# Altium schematic sheet MainBoard.SchDoc
size A2
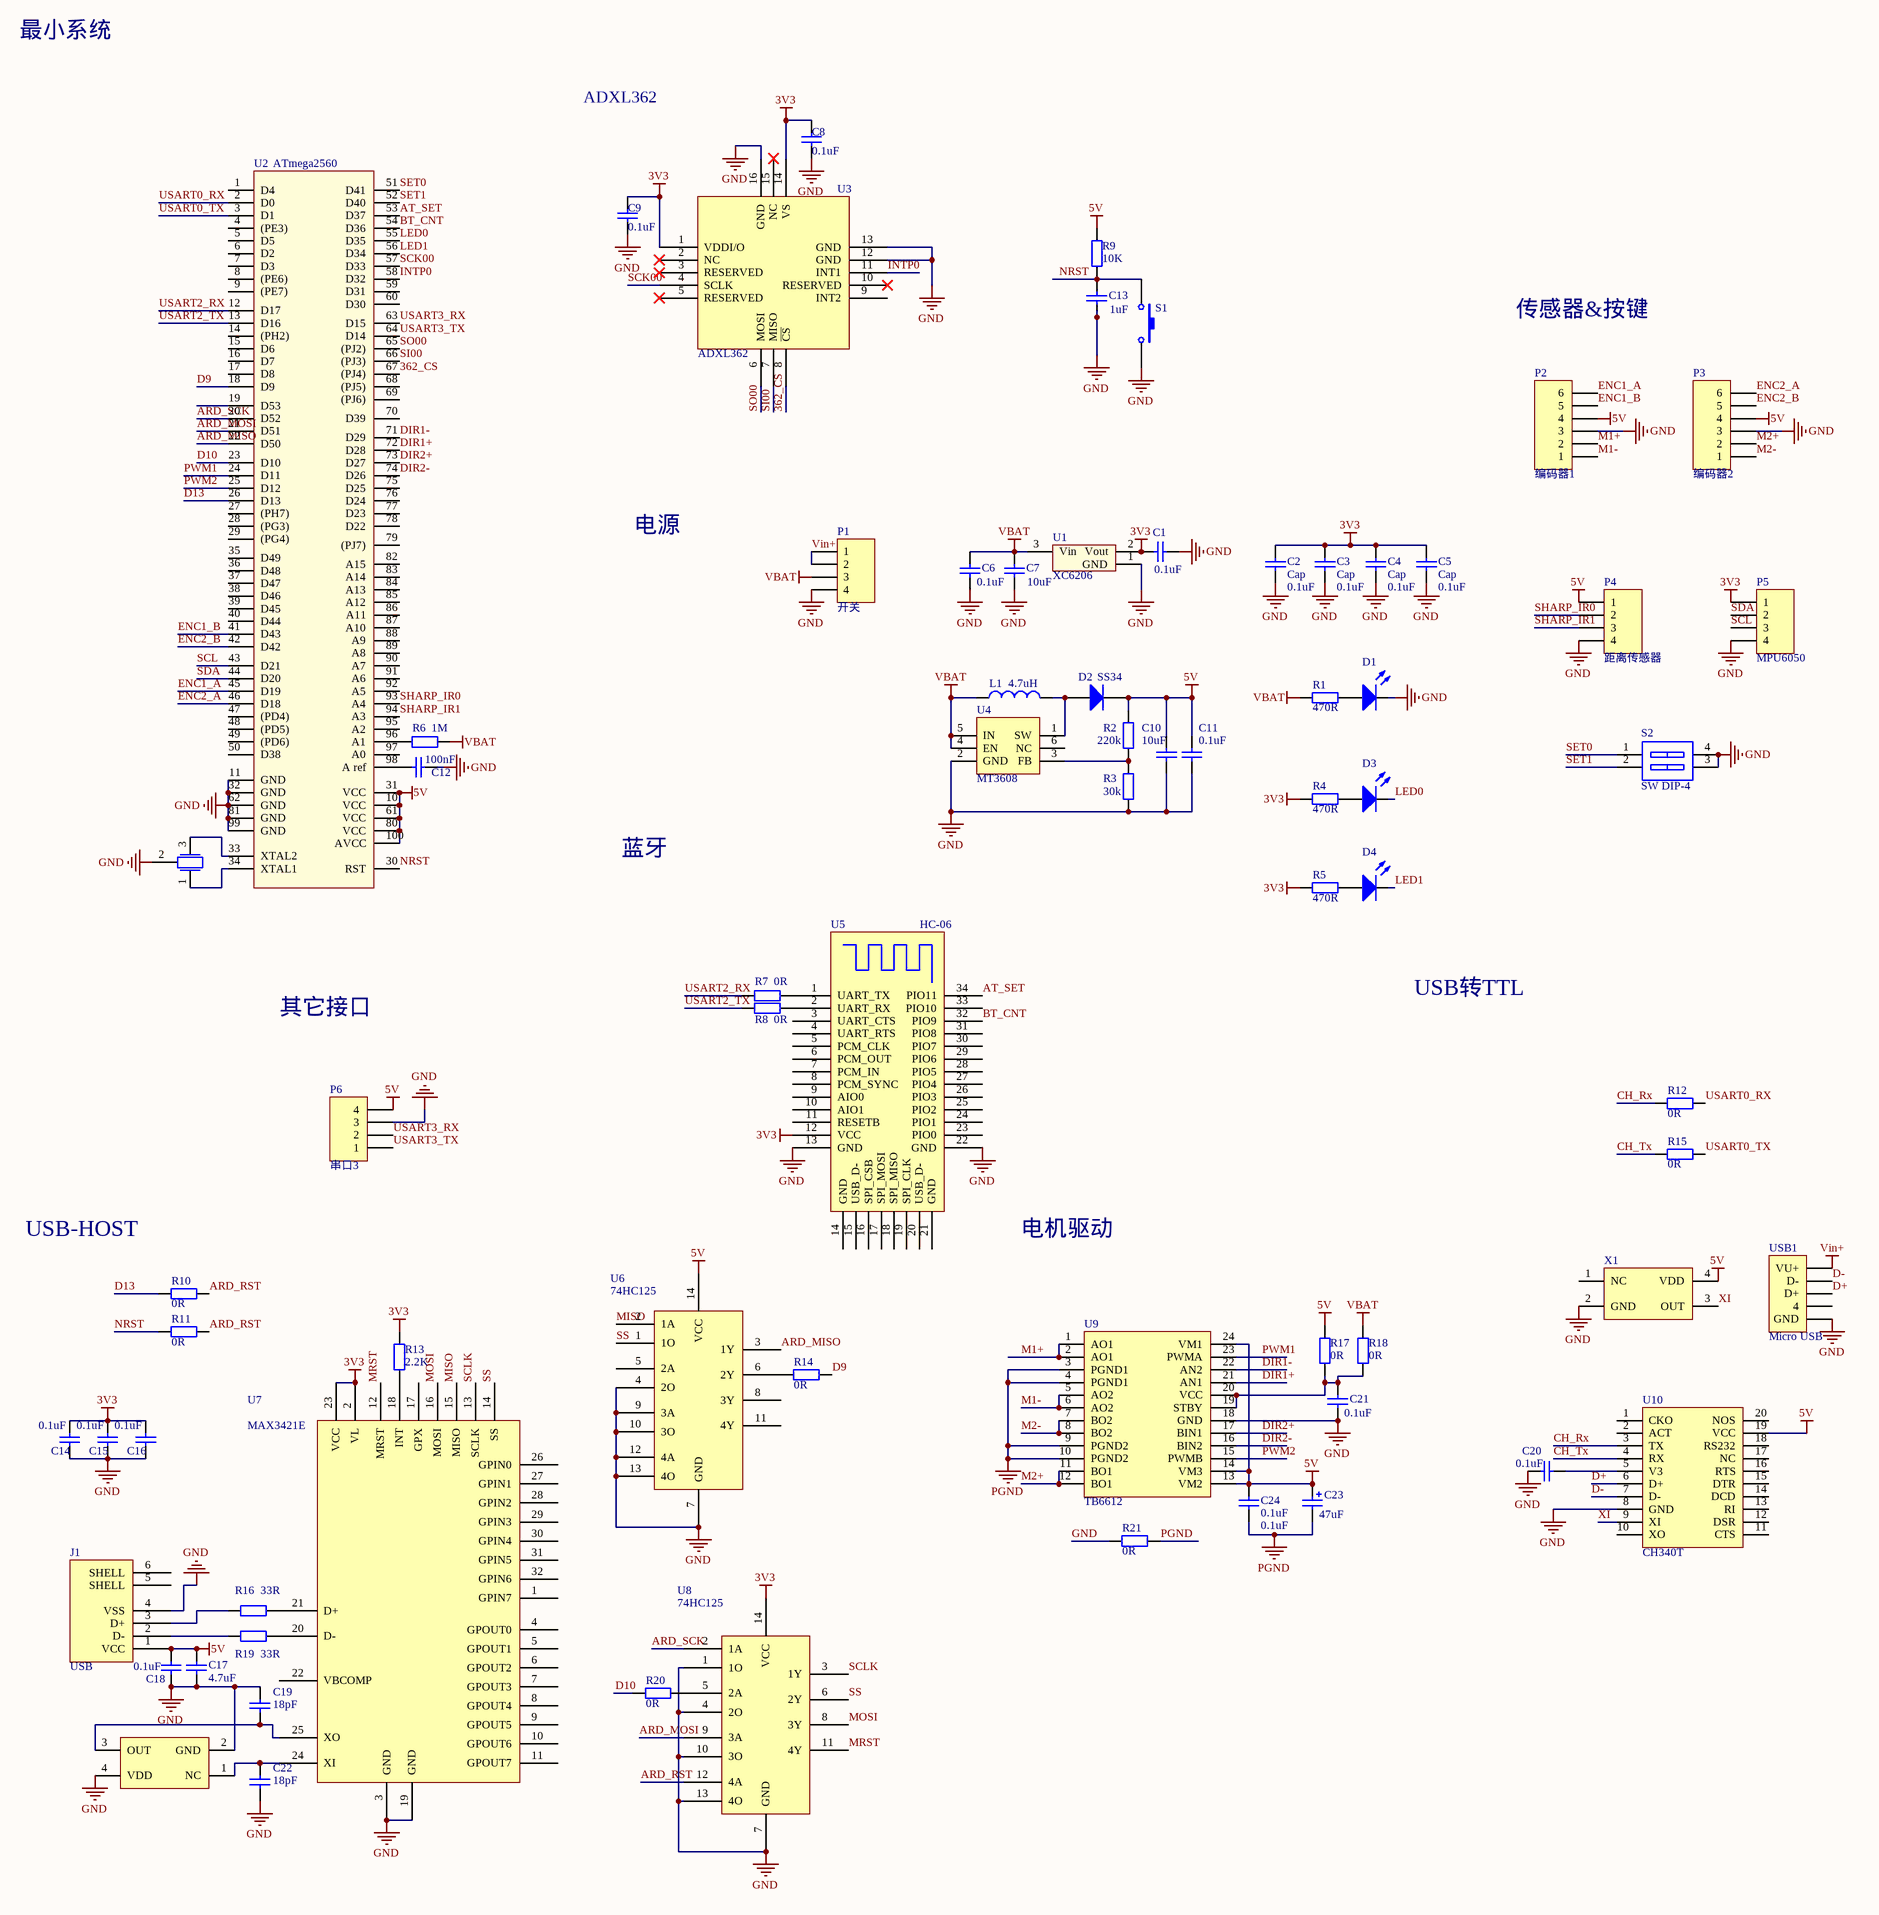
[diagram p0: MainBoard.SchDoc]

## Parts
*1  5032晶振  [5032晶振]  (value not drawn)
C1  value 0.1uF  [0402C]  (hidden comment: Cap)
C2  Cap  value 0.1uF  [0402C]
C3  Cap  value 0.1uF  [0402C]
C4  Cap  value 0.1uF  [0402C]
C5  Cap  value 0.1uF  [0402C]
C6  value 0.1uF  [0402C]  (hidden comment: Cap)
C7  value 10uF  [0603_M]  (hidden comment: Cap)
C8  0.1uF  [0805]
C9  0.1uF  [0805]
C10  10uF  [0603_M]
C11  0.1uF  [0402C]
C12  value 100nF  [0402]  (hidden comment: 电容_0402)
C13  value 1uF  [0402C]  (hidden comment: Cap)
C14  value 0.1uF  [0402]  (hidden comment: 电容_0603)
C15  value 0.1uF  [0402]  (hidden comment: 电容_0603)
C16  value 0.1uF  [0402]  (hidden comment: 电容_0603)
C17  value 4.7uF  [C1206]  (hidden comment: Cap Semi)
C18  value 0.1uF  [0402]  (hidden comment: 电容_0603)
C19  value 18pF  [0402]  (hidden comment: 电容_0603)
C20  value 0.1uF  [0402C]  (hidden comment: Cap)
C21  value 0.1uF  [0603_M]  (hidden comment: value)
C22  value 18pF  [0402]  (hidden comment: 电容_0603)
C23  value 47uF  [CAP 6X7mm 贴片电解]  (hidden comment: 钽电容6x7mm)
C24  0.1uF  [0603_M]
D1  LED  [0603_M]  (value not drawn)
D2  SS34  [DO-214]
D3  LED  [0603_M]  (value not drawn)
D4  LED  [0603_M]  (value not drawn)
J1  USB  [USB_A1]
L1  4.7uH  [贴片电感CD32]
P1  开关  [HDR1X4]
P2  编码器1  [接插件6x1.25mm]
P3  编码器2  [接插件6x1.25mm]
P4  距离传感器  [接插件4x1.25mm]
P5  MPU6050  [接插件4x1.25mm]
P6  串口3  [接插件4x1.25mm]
R1  value 470R  [0402C]  (hidden comment: 电阻_0402)
R2  220k  [0603_M]
R3  30k  [0603_M]
R4  value 470R  [0402C]  (hidden comment: 电阻_0402)
R5  value 470R  [0402C]  (hidden comment: 电阻_0402)
R6  value 1M  [0402C]  (hidden comment: 电阻_0402)
R7  value 0R  [0R电阻]  (hidden comment: 0R电阻)
R8  value 0R  [0R电阻]  (hidden comment: 0R电阻)
R9  value 10K  [0402C]  (hidden comment: Res2)
R10  value 0R  [0R电阻]  (hidden comment: 0R电阻)
R11  value 0R  [0R电阻]  (hidden comment: 0R电阻)
R12  value 0R  [0R电阻]  (hidden comment: 0R电阻)
R13  value 2.2K  [0603_M]  (hidden comment: 电阻_0603)
R14  value 0R  [0R电阻]  (hidden comment: 0R电阻)
R15  value 0R  [0R电阻]  (hidden comment: 0R电阻)
R16  value 33R  [0603_M]  (hidden comment: 电阻_0603)
R17  value 0R  [0R电阻]  (hidden comment: 0R电阻)
R18  value 0R  [0R电阻]  (hidden comment: 0R电阻)
R19  value 33R  [0603_M]  (hidden comment: 电阻_0603)
R20  value 0R  [0R电阻]  (hidden comment: 0R电阻)
R21  value 0R  [0R电阻]  (hidden comment: 0R电阻)
S1  SW-PB  [SW_PB2_A1]  (value not drawn)
S2  SW DIP-4  [SW8_4BIT]
U1  XC6206  [SOT-23]
U2  ATmega2560  [QFP-100]
U3  ADXL362  [MAX21100]
U4  MT3608  [SOT23-6]
U5  HC-06  [HM_01_02_09_10]
U6  74HC125  [SOIC-14]
U7  MAX3421E  [TQFP-32]
U8  74HC125  [SOIC-14]
U9  TB6612  [SOP65P760-24]
U10  CH340T  [SSOP20]
USB1  Micro USB  [USB MICRO]
X1  5032晶振  [5032晶振]  (value not drawn)
Y1  XTAL-3PIN  [X-CPX20]  (value not drawn)

## Nets
3V3: C1.1 C2.2 C3.2 C4.2 C5.2 C8.2 C9.2 C14.1 C15.1 C16.1 P5.1 R4.1 R5.1 R13.2 U1.2(Vout) U3.1(VDDI/O) U3.14(VS) U5.12(VCC) U7.2(VL) U7.23(VCC) U8.14(VCC)
5V: C10.2 C11.2 C17.2 C18.1 C23.1 C24.2 D2.2(K) J1.1(VCC) P2.4 P3.4 P4.1 P6.4 R2.1 R9.2 R17.2 U2.10(VCC) U2.31(VCC) U2.61(VCC) U2.80(VCC) U2.100(AVCC) U6.14(VCC) U9.13(VM2) U9.14(VM3) U9.24(VM1) U10.19(VCC) X1.4(VDD)
GND: *1.2(GND) *1.4(VDD) C1.2 C2.1 C3.1 C4.1 C5.1 C6.1 C7.1 C8.1 C9.1 C10.1 C11.1 C12.1 C13.1 C14.2 C15.2 C16.2 C17.1 C18.2 C19.1 C20.1 C21.1 C22.2 D1.2(K) J1.4(VSS) P1.4 P2.3 P3.3 P4.4 P5.4 P6.3 R3.2 R21.1 S1.2 S2.3(B2) S2.4(B1) U1.1(GND) U2.11(GND) U2.32(GND) U2.62(GND) U2.81(GND) U2.99(GND) U3.12(GND) U3.13(GND) U3.16(GND) U4.2(GND) U5.13(GND) U5.22(GND) U6.4(2O) U6.7(GND) U6.9(3A) U6.10(3O) U6.12(4A) U6.13(4O) U7.3(GND) U7.19(GND) U8.1(1O) U8.4(2O) U8.7(GND) U8.10(3O) U8.13(4O) U9.18(GND) U10.8(GND) USB1.5(GND) X1.2(GND) Y1.2
PGND: C23.2 C24.1 R21.2 U9.3(PGND1) U9.4(PGND1) U9.9(PGND2) U9.10(PGND2)
VBAT: C6.2 C7.2 L1.1 P1.3 R1.1 R6.2 R18.2 U1.3(Vin) U4.4(EN) U4.5(IN)
Vin+: P1.1 P1.2 USB1.1(VU+)
362_CS: U2.67((PJ4)) U3.8(~{CS})
ARD_MISO: U2.22(D50) U6.3(1Y)
ARD_MOSI: U2.21(D51) U8.9(3A)
ARD_RST: R10.2 R11.2 U8.12(4A)
ARD_SCK: U2.20(D52) U8.2(1A)
AT_SET: U2.53(D37) U5.34(PIO11)
BT_CNT: U2.54(D36) U5.32(PIO9)
CH_Rx: R12.1 U10.3(TX)
CH_Tx: R15.1 U10.4(RX)
D9: R14.2 U2.18(D9)
D10: R20.1 U2.23(D10)
D13: R10.1 U2.26(D13)
D+: U10.6(D+) USB1.3(D+)
D-: U10.7(D-) USB1.2(D-)
DIR1+: U2.72(D28) U9.21(AN1)
DIR1-: U2.71(D29) U9.22(AN2)
DIR2+: U2.73(D27) U9.17(BIN1)
DIR2-: U2.74(D26) U9.16(BIN2)
ENC1_A: P2.6 U2.45(D19)
ENC1_B: P2.5 U2.41(D43)
ENC2_A: P3.6 U2.46(D18)
ENC2_B: P3.5 U2.42(D42)
INTP0: U2.58(D32) U3.11(INT1)
LED0: D3.2(K) U2.55(D35)
LED1: D4.2(K) U2.56(D34)
M1+: P2.2 U9.1(AO1) U9.2(AO1)
M1-: P2.1 U9.5(AO2) U9.6(AO2)
M2+: P3.2 U9.11(BO1) U9.12(BO1)
M2-: P3.1 U9.7(BO2) U9.8(BO2)
MISO: U6.2(1A) U7.15(MISO)
MOSI: U7.16(MOSI) U8.8(3Y)
MRST: U7.12(MRST) U8.11(4Y)
NRST: C13.2 R9.1 R11.1 S1.1 U2.30(RST)
PWM1: U2.24(D11) U9.23(PWMA)
PWM2: U2.25(D12) U9.15(PWMB)
SCK00: U2.57(D33) U3.4(SCLK)
SCL: P5.3 U2.43(D21)
SCLK: U7.13(SCLK) U8.3(1Y)
SDA: P5.2 U2.44(D20)
SET0: S2.1(A1) U2.51(D41)
SET1: S2.2(A2) U2.52(D40)
SHARP_IR0: P4.2 U2.93(A4)
SHARP_IR1: P4.3 U2.94(A3)
SI00: U2.66((PJ3)) U3.7(MISO)
SO00: U2.65((PJ2)) U3.6(MOSI)
SS: U6.1(1O) U7.14(SS) U8.6(2Y)
USART0_RX: R12.2 U2.2(D0)
USART0_TX: R15.2 U2.3(D1)
USART2_RX: R7.1 U2.12(D17)
USART2_TX: R8.1 U2.13(D16)
USART3_RX: P6.2 U2.63(D15)
USART3_TX: P6.1 U2.64(D14)
XI: U10.9(XI) X1.3(OUT)
Net*1_1: *1.1(NC) C22.1 U7.24(XI)
Net*1_3: *1.3(OUT) C19.2 U7.25(XO)
NetC12_2: C12.2 U2.98(A_ref)
NetC20_2: C20.2 U10.5(V3)
NetC21_2: C21.2 R17.1 R18.1 U9.19(STBY) U9.20(VCC)
NetD1_1: D1.1(A) R1.2
NetD2_1: D2.1(A) L1.2 U4.1(SW)
NetD3_1: D3.1(A) R4.2
NetD4_1: D4.1(A) R5.2
NetJ1_2: J1.2(D-) R19.1
NetJ1_3: J1.3(D+) R16.1
NetR2_2: R2.2 R3.1 U4.3(FB)
NetR6_1: R6.1 U2.96(A1)
NetR7_2: R7.2 U5.1(UART_TX)
NetR8_2: R8.2 U5.2(UART_RX)
NetR13_1: R13.1 U7.18(INT)
NetR14_1: R14.1 U6.6(2Y)
NetR16_2: R16.2 U7.21(D+)
NetR19_2: R19.2 U7.20(D-)
NetR20_2: R20.2 U8.5(2A)
NetU2_33: U2.33(XTAL2) Y1.3
NetU2_34: U2.34(XTAL1) Y1.1

Not connected (* = marked no-connect by the designer): J1 5(SHELL) 6(SHELL); U2 1(D4) 4((PE3)) 5(D5) 6(D2) 7(D3) 8((PE6)) 9((PE7)) 14((PH2)) 15(D6) 16(D7) 17(D8) 19(D53) 27((PH7)) 28((PG3)) 29((PG4)) 35(D49) 36(D48) 37(D47) 38(D46) 39(D45) 40(D44) 47((PD4)) 48((PD5)) 49((PD6)) 50(D38) 59(D31) 60(D30) 68((PJ5)) 69((PJ6)) 70(D39) 75(D25) 76(D24) 77(D23) 78(D22) 79((PJ7)) 82(A15) 83(A14) 84(A13) 85(A12) 86(A11) 87(A10) 88(A9) 89(A8) 90(A7) 91(A6) 92(A5) 95(A2) 97(A0); U3 2(NC)* 3(RESERVED)* 5(RESERVED)* 9(INT2) 10(RESERVED)* 15(NC)*; U4 6(NC); U5 3(UART_CTS) 4(UART_RTS) 5(PCM_CLK) 6(PCM_OUT) 7(PCM_IN) 8(PCM_SYNC) 9(AIO0) 10(AIO1) 11(RESETB) 14(GND) 15(USB_D-) 16(SPI_CSB) 17(SPI_MOSI) 18(SPI_MISO) 19(SPI_CLK) 20(USB_D-) 21(GND) 23(PIO0) 24(PIO1) 25(PIO2) 26(PIO3) 27(PIO4) 28(PIO5) 29(PIO6) 30(PIO7) 31(PIO8) 33(PIO10); U6 5(2A) 8(3Y) 11(4Y); U7 1(GPIN7) 4(GPOUT0) 5(GPOUT1) 6(GPOUT2) 7(GPOUT3) 8(GPOUT4) 9(GPOUT5) 10(GPOUT6) 11(GPOUT7) 17(GPX) 22(VBCOMP) 26(GPIN0) 27(GPIN1) 28(GPIN2) 29(GPIN3) 30(GPIN4) 31(GPIN5) 32(GPIN6); U10 1(CKO) 2(ACT) 10(XO) 11(CTS) 12(DSR) 13(RI) 14(DCD) 15(DTR) 16(RTS) 17(NC) 18(RS232) 20(NOS); USB1 4; X1 1(NC)

## Notes on the sheet
- 最小系统
- ADXL362
- 传感器&按键
- 电源
- 蓝牙
- 其它接口
- USB转TTL
- USB-HOST
- 电机驱动

## Library data of the parts
C1-C7 C13 C20 C21 C24 = Cap: Capacitor; Published: 8-Jun-2000; LatestRevisionDate: 17-Jul-2002; LatestRevisionNote: Re-released for DXP Platform.; PackageReference: RAD-0.3; Publisher: Altium Limited
  C1-C7 C13 C20: PackageDescription: Radial Cap, Thru-Hole; 2 Leads; 0.3 in Pin Spacing
  C24: Value: 0.1uF
C8 C9 = Cap2: Capacitor 0805; Value: 100pF; Published: 8-Jun-2000; Revision: July-2002: Re-released for DXP Platform.; Publisher: Altium Limited
C10 = Cap: Capacitor 100nF (104) ±10% 25V 0603; Published: 8-Jun-2000; LatestRevisionDate: 17-Jul-2002; LatestRevisionNote: Re-released for DXP Platform.; PackageReference: RAD-0.3; Publisher: Altium Limited; Value: 10uF
C11 C17 = Cap Semi: Capacitor (Semiconductor SIM Model); Published: 8-Jun-2000; PackageReference: C1206; Publisher: Altium Limited
  C11: LatestRevisionDate: 17-Jul-2002; LatestRevisionNote: Re-released for DXP Platform.; Value: 0.1uF
  C17: LatestRevisionDate: 29-May-2009; LatestRevisionNote: IPC-7351 Footprint Added.; PackageDescription: Chip Capacitor
C12 = 电容_0402: Capacitor; Published: 8-Jun-2000; LatestRevisionDate: 17-Jul-2002; LatestRevisionNote: Re-released for DXP Platform.; PackageReference: RAD-0.3; Publisher: Altium Limited; PackageDescription: Radial Cap, Thru-Hole; 2 Leads; 0.3 in Pin Spacing
C14-C16 C18 C19 C22 = 电容_0603: Capacitor; Published: 8-Jun-2000; LatestRevisionDate: 17-Jul-2002; LatestRevisionNote: Re-released for DXP Platform.; PackageReference: RAD-0.3; Publisher: Altium Limited; PackageDescription: Radial Cap, Thru-Hole; 2 Leads; 0.3 in Pin Spacing
C23 = 钽电容6x7mm: Polarized Capacitor (Radial); Published: 8-Jun-2000; LatestRevisionDate: 17-Jul-2002; LatestRevisionNote: Re-released for DXP Platform.; PackageReference: RB7.6-15; Publisher: Altium Limited; PackageDescription: Polarized Capacitor (Radial); 2 Leads
D1 D3 D4 = LED0: Typical INFRARED GaAs LED; Published: 8-Jun-2000; LatestRevisionDate: 08-Jul-2005; LatestRevisionNote: Mech Layer 1 removed.; PackageReference: LED-0; Publisher: Altium Limited; PackageDescription: LED; 2 Leads
D2 = Diode: Diode  SS34 DO214-AC; Published: 8-Jun-2000; LatestRevisionDate: 17-Jul-2002; LatestRevisionNote: Re-released for DXP Platform.; PackageDocument: Sep-1996; PackageReference: SMC; Publisher: Altium Limited; Code_JEDEC: DO-214-AB; Value: SS34
J1 = USB: USB接口
L1 = 贴片电感: Inductor, 6.8uH, 4.5A, 1054 SMD; Code_IEC: 1005; Value: GDCD1054-6R8MT; Published: 8-Jun-2000; LatestRevisionDate: 17-Jul-2002; LatestRevisionNote: Re-released for DXP Platform.; PackageReference: 0402-A; Publisher: Altium Limited; Code_JEITA: 0402
P1 = Header 4: Header, 4-Pin; LatestRevisionDate: 17-Jul-2002; LatestRevisionNote: Re-released for DXP Platform.; Publisher: Altium Limited
P2 P3 = 接插件6x1.25mm_1
P4 = MHDR1X4: Header, 4-Pin; LatestRevisionDate: 17-Jul-2002; LatestRevisionNote: Re-released for DXP Platform.; Publisher: Altium Limited
P5 P6 = 接插件4x1.25mm
R1 R4-R6 = 电阻_0402: Resistor; Published: 8-Jun-2000; LatestRevisionDate: 17-Jul-2002; LatestRevisionNote: Re-released for DXP Platform.; PackageReference: AXIAL-0.4; Publisher: Altium Limited; PackageDescription: Axial Device, Thru-Hole; 2 Leads; 0.4 in Pin Spacing
R2 R3 = Res2: Resistor, 22R 1% 0603 (1608); Published: 8-Jun-2000; LatestRevisionDate: 17-Jul-2002; LatestRevisionNote: Re-released for DXP Platform.; PackageReference: AXIAL-0.4; Publisher: Altium Limited
  R2: Value: 220k
  R3: Value: 30k
R7 R8 R10-R12 R14 R15 R17 R18 R20 R21 = 0R电阻: Resistor; Published: 8-Jun-2000; LatestRevisionDate: 17-Jul-2002; LatestRevisionNote: Re-released for DXP Platform.; PackageReference: AXIAL-0.4; Publisher: Altium Limited; PackageDescription: Axial Device, Thru-Hole; 2 Leads; 0.4 in Pin Spacing
R9 = Res2: Resistor; Published: 8-Jun-2000; LatestRevisionDate: 17-Jul-2002; LatestRevisionNote: Re-released for DXP Platform.; PackageReference: AXIAL-0.4; Publisher: Altium Limited; PackageDescription: Axial Device, Thru-Hole; 2 Leads; 0.4 in Pin Spacing
R13 R16 R19 = 电阻_0603: Resistor; Published: 8-Jun-2000; LatestRevisionDate: 17-Jul-2002; LatestRevisionNote: Re-released for DXP Platform.; PackageReference: AXIAL-0.4; Publisher: Altium Limited; PackageDescription: Axial Device, Thru-Hole; 2 Leads; 0.4 in Pin Spacing
S1 = SW-PB: 微动开关; Published: 24-Mar-1999; LatestRevisionDate: 17-Jul-2002; LatestRevisionNote: Re-released for DXP Platform.; PackageReference: SPST-2; Publisher: Altium Limited
S2 = SW DIP-4: 编码开关; Published: 24-Mar-1999; LatestRevisionDate: 17-Jul-2002; LatestRevisionNote: Re-released for DXP Platform.; PackageReference: SO8; Publisher: Altium Limited; Code_JEDEC: MS-012-AA; Code_IPC: SO8
U4 = MT3608: 升压IC
U5 = HM01_02_09_1: HM bluetooth module HM-01,HM-02,HM-09
USB1 = Micro USB: USB; LatestRevisionDate: 17-Jul-2002; LatestRevisionNote: Re-released for DXP Platform.; Publisher: Altium Limited
Y1 = XTAL-3PIN: 贴片晶振